# EAGLE design mosquino-pwr-stepup-ti (EAGLE 5.06)
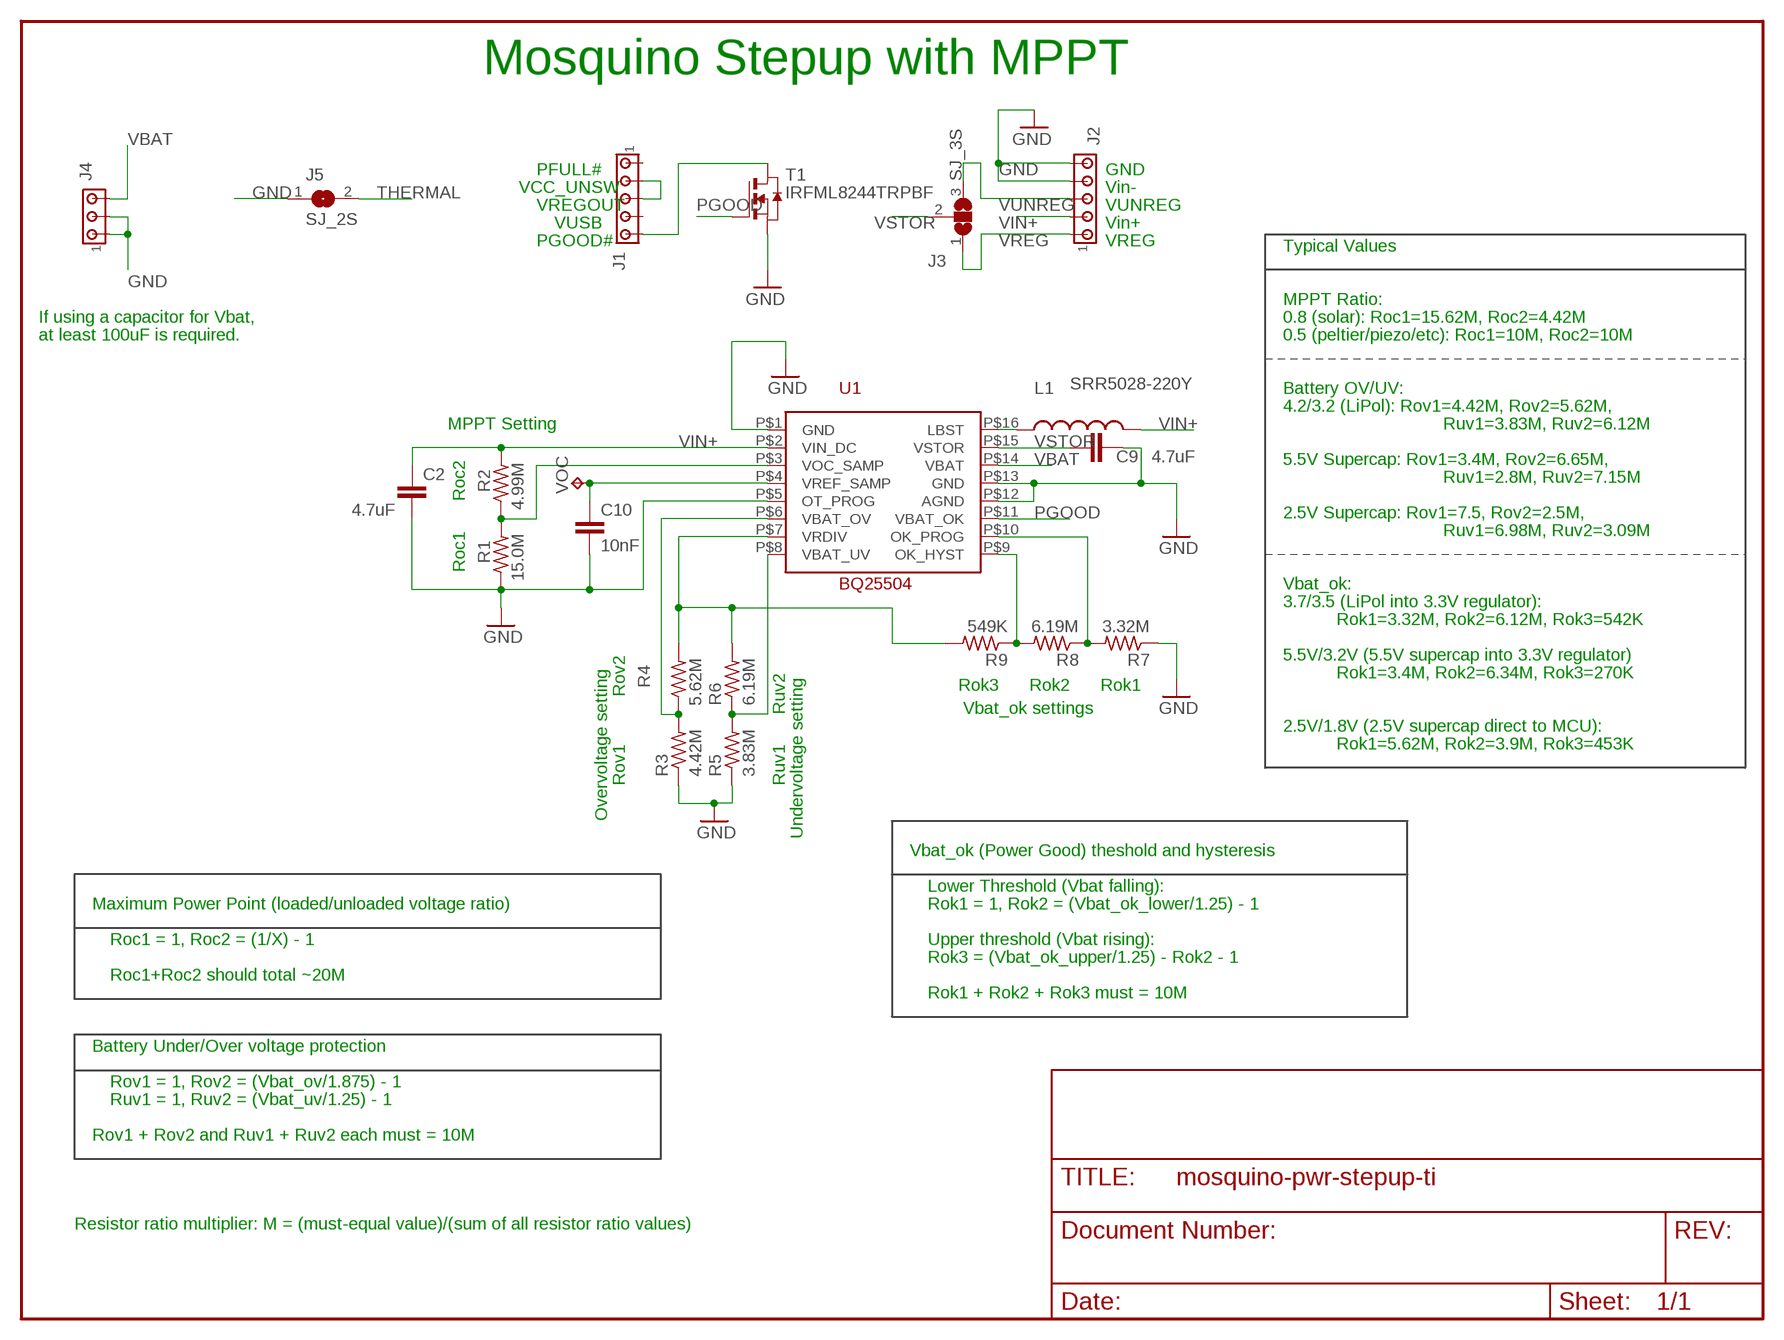
[diagram p0: schematic, sheet 1]

## Parts
C2  4.7uF  C-EUC0805  [C0805]
C9  4.7uF  C-EUC0805  [C0805]
C10  10nF  C-EUC0805  [C0805]
J1  MTA05-100  [10X05MTA]
J2  MTA05-100  [10X05MTA]
J3  SJ_3S  [SJ3_S]
J4  MTA03-100  [10X03MTA]
J5  SJ_2S  [SJ2_S]
L1  SRR5028-220Y  SDR0604  [SDR0604]
R1  15.0M  R-US_R0805  [R0805]
R2  4.99M  R-US_R0805  [R0805]
R3  4.42M  R-US_R0805  [R0805]
R4  5.62M  R-US_R0805  [R0805]
R5  3.83M  R-US_R0805  [R0805]
R6  6.19M  R-US_R0805  [R0805]
R7  3.32M  R-US_R0805  [R0805]
R8  6.19M  R-US_R0805  [R0805]
R9  549K  R-US_R0805  [R0805]
T1  IRFML8244TRPBF  NMOSSOT23  [SOT-23]
U1  BQ25504  [PVQFN-16-3X3MM]
VOC  TPB1,27  [B1,27]

## Nets
GND [pwr]: C2.2 C9.1 C10.2 J2.4 J2.5 J4.1 J4.2 J5.1 R1.1 R3.1 R5.1 R7.1 T1.2(S) U1.P$1(GND) U1.P$5(OT_PROG) U1.P$12(AGND) U1.P$13(GND)
N$1: R1.2 R2.1 U1.P$3(VOC_SAMP)
N$2: C10.1 U1.P$4(VREF_SAMP) VOC.PP(TP)
N$3: L1.1 U1.P$16(LBST)
N$6: J1.5 T1.1(D)
N$16: J1.2 J1.3
OK_HYST: R8.2 R9.1 U1.P$9(OK_HYST)
OK_PROG: R7.2 R8.1 U1.P$10(OK_PROG)
PGOOD: T1.3(G) U1.P$11(VBAT_OK)
THERMAL: J5.2
VBAT: J4.3 U1.P$14(VBAT)
VBAT_OV: R3.2 R4.1 U1.P$6(VBAT_OV)
VBAT_UV: R5.2 R6.1 U1.P$8(VBAT_UV)
VIN+: C2.1 J2.2 L1.2 R2.2 U1.P$2(VIN_DC)
VRDIV: R4.2 R6.2 R9.2 U1.P$7(VRDIV)
VREG: J2.1 J3.1
VSTOR: C9.2 J3.2 U1.P$15(VSTOR)
VUNREG: J2.3 J3.3
Unconnected: J1.1 J1.4

## Notes on the sheet
- Mosquino Stepup with MPPT
- PFULL# | GND
- VCC_UNSW | Vin-
- VREGOUT | VUNREG
- VUSB | Vin+
- PGOOD# | VREG
- Typical Values
- MPPT Ratio:
- If using a capacitor for Vbat, | 0.8 (solar): Roc1=15.62M, Roc2=4.42M
- at least 100uF is required. | 0.5 (peltier/piezo/etc): Roc1=10M, Roc2=10M
- Battery OV/UV:
- 4.2/3.2 (LiPol): Rov1=4.42M, Rov2=5.62M,
- MPPT Setting | Ruv1=3.83M, Ruv2=6.12M
- 5.5V Supercap: Rov1=3.4M, Rov2=6.65M,
- Ruv1=2.8M, Ruv2=7.15M
- Roc2
- 2.5V Supercap: Rov1=7.5, Rov2=2.5M,
- Ruv1=6.98M, Ruv2=3.09M
- Roc1
- Vbat_ok:
- 3.7/3.5 (LiPol into 3.3V regulator):
- Rok1=3.32M, Rok2=6.12M, Rok3=542K
- 5.5V/3.2V (5.5V supercap into 3.3V regulator)
- Rok3 | Rok2 | Rok1 | Rok1=3.4M, Rok2=6.34M, Rok3=270K
- Rov2
- Ruv2 | Vbat_ok settings
- 2.5V/1.8V (2.5V supercap direct to MCU):
- Rok1=5.62M, Rok2=3.9M, Rok3=453K
- Rov1 | Ruv1
- Overvoltage setting
- Undervoltage setting
- Vbat_ok (Power Good) theshold and hysteresis
- Lower Threshold (Vbat falling):
- Maximum Power Point (loaded/unloaded voltage ratio) | Rok1 = 1, Rok2 = (Vbat_ok_lower/1.25) - 1
- Roc1 = 1, Roc2 = (1/X) - 1 | Upper threshold (Vbat rising):
- Rok3 = (Vbat_ok_upper/1.25) - Rok2 - 1
- Roc1+Roc2 should total ~20M
- Rok1 + Rok2 + Rok3 must = 10M
- Battery Under/Over voltage protection
- Rov1 = 1, Rov2 = (Vbat_ov/1.875) - 1
- Ruv1 = 1, Ruv2 = (Vbat_uv/1.25) - 1
- Rov1 + Rov2 and Ruv1 + Ruv2 each must = 10M
- Resistor ratio multiplier: M = (must-equal value)/(sum of all resistor ratio values)

## Library data of the parts
C2 C9 C10 = rcl:C-EU: CAPACITOR, European symbol
J1 J2 = con-amp:MTA05-100: AMP connector
J3 = mideeval:SJ_3S: Small solder jumper, 3 pin. 20060130 / tgipson
J4 = con-amp:MTA03-100: AMP connector
J5 = mideeval:SJ_2S: Small solder jumper, 2 pin. 20060130 / tgipson
L1 = mideeval:SDR0604: SDR0604 Series SMD power inductor Bourns JR 2008.11.26
R1-R9 = rcl:R-US_: RESISTOR, American symbol
T1 = zetex:NMOSSOT23: MOS FET
U1 = tim:BQ25504: TI BQ25504 ultra low power boost converter with battery management. 20120216 / tgipson
VOC = testpad:TP: Test pad

## Net classes
1 pwr: width 0.305 mm, drill 0.508 mm, clearance 0.203 mm
4 digital: width 0.203 mm, drill 0.381 mm, clearance 0.203 mm

## Board
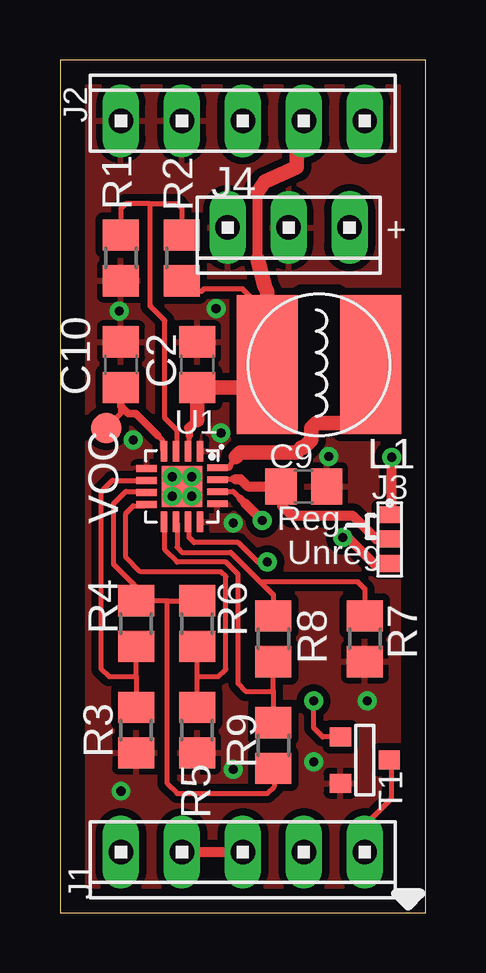
[diagram p1: board, top side]
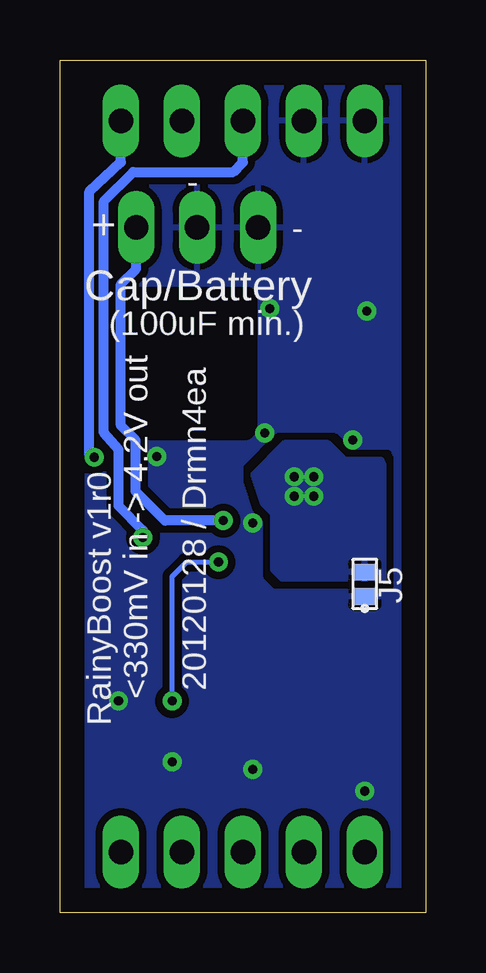
[diagram p2: board, bottom side, seen from below]

Size 15.24 x 35.56 mm. Coordinates in mm from the lower left corner, seen from the top.
Outline: 15.24,35.56 0,35.56 0,0 15.24,0 15.24,35.56
Copper layers (1*16): Top 0.035mm / dielectric 1.5mm / Bottom 0.035mm
Design rules "default": minimum track width 8mil, minimum drill 15mil, track to track 8mil, track to pad 8mil, pad to pad 8mil, via to via 8mil, smd to smd 8mil, copper to edge 40mil, drill to drill 8mil, minimum pad ring 10mil, minimum via ring 8mil, stop-mask expansion 4mil, vias tented up to drill 0mil, thermal gap 10mil
tRestrict: area 10.1,21 to 11.6,25.8
bRestrict: area 7.4,20.1 to 12.1,25.7

### Footprints (pad centres in the part's own frame; a part is rotated, then mirrored left to right if it is on the bottom)
C0805 = smd 1.3 x 1.5: 1 -0.95,0; 2 0.95,0
10X05MTA = drill 1.016 long: 1 5.08,0; 2 2.54,0; 3 0,0; 4 -2.54,0; 5 -5.08,0
SJ3_S = smd 0.7 x 0.9: 1 -1.031,0; 2 -0.015,0; 3 1.001,0
10X03MTA = drill 1.016 long: 1 2.54,0; 2 0,0; 3 -2.54,0
SJ2_S = smd 0.7 x 0.9: 1 -0.523,0; 2 0.493,0
SDR0604 = smd 5.791 x 2.54: 1 0,2.159; 2 0,-2.159
R0805 = smd 1.3 x 1.5: 1 -0.95,0; 2 0.95,0
SOT-23 = smd 0.787 x 0.889: 1 0.025,-1.016; 2 -0.94,1.016; 3 0.991,1.016
PVQFN-16-3X3MM = smd 0.85 x 0.28: P$1 -1.475,0.75; P$2 -1.475,0.25; P$3 -1.475,-0.25; P$4 -1.475,-0.75; P$9 1.475,-0.75; P$10 1.475,-0.25; P$11 1.475,0.25; P$12 1.475,0.75 | smd 0.28 x 0.85: P$5 -0.75,-1.475; P$6 -0.25,-1.475; P$7 0.25,-1.475; P$8 0.75,-1.475; P$13 0.725,1.475; P$14 0.225,1.475; P$15 -0.275,1.475; P$16 -0.775,1.475 | smd 1.7 x 1.7: P$17 0,0
B1,27 = smd 1.27 x 1.27: PP 0,0

### Placement (x,y rotation side)
C2  5.71,22.86 90 top
C9  10.16,17.78 180 top
C10  2.54,22.86 90 top
J1  7.62,2.54 180 top
J2  7.62,33.02 0 top
J3  13.74,15.57 270 top
J4  9.53,28.57 180 top
J5  2.54,13.72 90 bottom
L1  10.79,22.86 270 top
R1  2.54,27.3 90 top
R2  5.08,27.3 270 top
R3  3.17,7.62 90 top
R4  3.17,12.06 90 top
R5  5.71,7.62 90 top
R6  5.71,12.06 90 top
R7  12.7,11.43 90 top
R8  8.89,11.43 270 top
R9  8.89,6.99 270 top
T1  12.7,6.35 90 top
U1  5.08,17.78 270 top
VOC  1.93,20.22 0 top

### Tracks (layer width: path | path; a pad name or v marks a point on that pad's centre or on a via)
GND  (via drill 0.38)
  other vias: 11.2,19.02 12.8,8.84 10.57,6.3 7.21,5.99 2.54,5.08 6.71,20.02 2.46,25.1 6.5,25.2 3.05,19.71 7.21,16.26
  pour Top (isolate 0.305): 15.24,35.56 15.24,0 0,0 0,35.56
  pour Bottom (isolate 0.305, rank 2): 15.24,0 0,0 0,35.56 15.24,35.56
N$1
  Top 0.203: U1.P$3 4.88,19.3 4.88,20.12 4.37,20.62 4.37,24.69 3.76,25.3 3.76,29.57 | 3.76,29.57 4.88,29.57 5.08,29.36 R2.1 | 3.76,29.57 2.74,29.57 2.54,29.36 R1.2
N$2
  Top 0.203: U1.P$4 4.27,19.32 4.27,19.71 4.06,19.91 | VOC.PP 2.54,20.83 2.54,21.34
  Top 0.305: 4.06,19.91 3.15,20.83 2.85,20.83 2.54,21.13 2.54,21.34 C10.1
N$3
  Top 0.203: 7.21,18.9 7.07,18.55 U1.P$16
  Top 0.305: 7.21,18.9 7.32,19
  Top 0.61: 7.32,19 7.52,19.2 9.86,19.2 10.06,19.41 10.16,19.41 10.46,19.71 10.46,20.22 10.67,20.42 12.19,20.42 12.8,21.03 12.8,22.35 12.95,22.5 L1.1
N$6
  Top 0.203: T1.1 13.82,6.27 13.82,4.78 12.7,3.66 J1.5
N$16
  Top 0.406: J1.2 J1.3
OK_HYST
  Top 0.203: 8.89,9.25 R9.1 | 8.89,9.25 R8.2 | U1.P$9 4.37,16.27 4.37,15.14 4.88,14.63 6.91,14.63 7.42,14.12 7.42,9.55 7.72,9.25 8.89,9.25
OK_PROG
  Top 0.203: U1.P$10 4.88,16.26 4.88,15.24 5.08,15.04 7.11,15.04 8.33,13.82 | 8.33,13.82 8.89,13.26 R8.1 | R7.2 12.7,13.51 12.39,13.82 8.33,13.82
PGOOD  (via drill 0.38)
  Top 0.203: U1.P$11 5.38,16.25 5.38,15.65 5.59,15.44 7.42,15.44 8.23,14.63 v8.64,14.63 | v10.57,8.84 10.57,7.72 10.95,7.34 T1.3
  Bottom 0.203: v8.64,14.63 9.96,14.63 10.57,14.02 10.57,13.82 v10.57,8.84
THERMAL  (via drill 0.38)
  other vias: 4.67,18.19 5.49,18.19 4.67,17.37 5.49,17.37
  pour Bottom: 4.06,19.61 5.89,19.61 7.21,18.29 6.81,17.07 6.4,16.66 6.4,14.33 5.99,13.92 1.73,13.92 1.73,18.69 1.83,18.9 3.35,18.9
VBAT  (via drill 0.38)
  Top 0.203: U1.P$14 6.58,17.58 7.21,17.58 7.52,17.27
  Top 0.305: 7.52,17.27 7.72,17.07
  Top 0.406: 7.72,17.07 v8.43,16.36
  Bottom 0.406: v8.43,16.36 10.87,16.36 12.09,17.58 12.09,19.71 12.7,20.32 12.7,26.21 12.06,26.85 J4.3
VBAT_OV
  Top 0.203: U1.P$6 2.18,18.03 1.73,17.58 1.73,10.16 2.03,9.86 3.17,9.86 | 3.17,9.86 R3.2 | 3.17,9.86 R4.1
VBAT_UV
  Top 0.203: U1.P$8 3.54,16.97 3.05,16.97 2.74,16.66 2.74,14.83 3.35,14.22 6.71,14.22 6.91,14.02 6.91,10.16 6.6,9.86 5.71,9.86 | R5.2 5.71,9.86 | 5.71,9.86 R6.1
VIN+
  Top 0.203: U1.P$2 5.38,19.31 5.38,19.91 | R2.2 5.53,25.91 5.89,25.91 5.99,26.01 7.62,26.01 8.64,24.99 L1.2
  Top 0.305: 5.38,19.91 5.38,20.22
  Top 0.406: 5.38,20.22 5.71,20.55 | L1.2 8.53,23.39 8.53,22.96 | 8.53,22.96 8.53,21.64 8.27,21.91 | 8.53,22.96 8.53,24.59 | 8.23,27.23 8.23,30.07
  Top 0.61: 5.71,20.55 C2.1 8.27,21.91 | J2.2 9.86,32.51 9.86,31.09 8.53,30.48 8.23,30.07 | 8.23,27.23 8.53,26.11 8.64,25.91 L1.2
VRDIV
  Top 0.203: U1.P$7 3.56,17.58 2.74,17.58 2.23,17.07 2.23,14.53 3.15,13.61 R4.2 4.47,13.02 | 4.47,13.02 R6.2 | R9.2 8.94,5.98 8.94,5.28 8.64,4.98 4.88,4.98 4.47,5.38 4.47,13.02
VREG  (via drill 0.38)
  Top 0.406: J3.1 13.82,16.68 v13.82,19
  Bottom 0.406: v13.82,19 14.02,19.1 14.02,30.07 12.7,31.29 J2.1
VSTOR
  Top 0.203: U1.P$15 6.58,18.09 7.21,18.09
  Top 0.305: 7.21,18.09 7.32,18.09
  Top 0.406: 7.32,18.09 7.52,18.09 7.82,17.78 C9.2 9.25,17.74 9.25,16.97 9.65,16.56 12.19,16.56 13.17,15.59 J3.2
VUNREG  (via drill 0.38)
  Top 0.406: J3.3 13.7,14.53 13.11,14.53 11.99,15.65 v11.79,15.65
  Bottom 0.406: J2.3 7.62,31.29 8.03,30.89 12.19,30.89 13.41,29.67 13.41,20.02 12.8,19.3 12.8,16.97 11.79,15.95 v11.79,15.65

### Text on the board
tPlace: +
tNames: Reg. | Unreg
bNames: - | - | + | Cap/Battery | (100uF min.) | 20120128 / Drmn4ea | <330mV in -> 4.2V out | RainyBoost v1r0